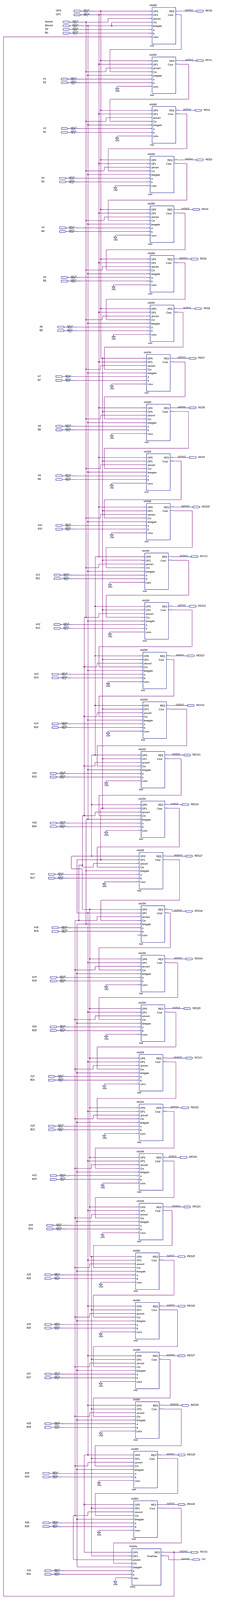
[diagram p0: schematic sheet, whole]
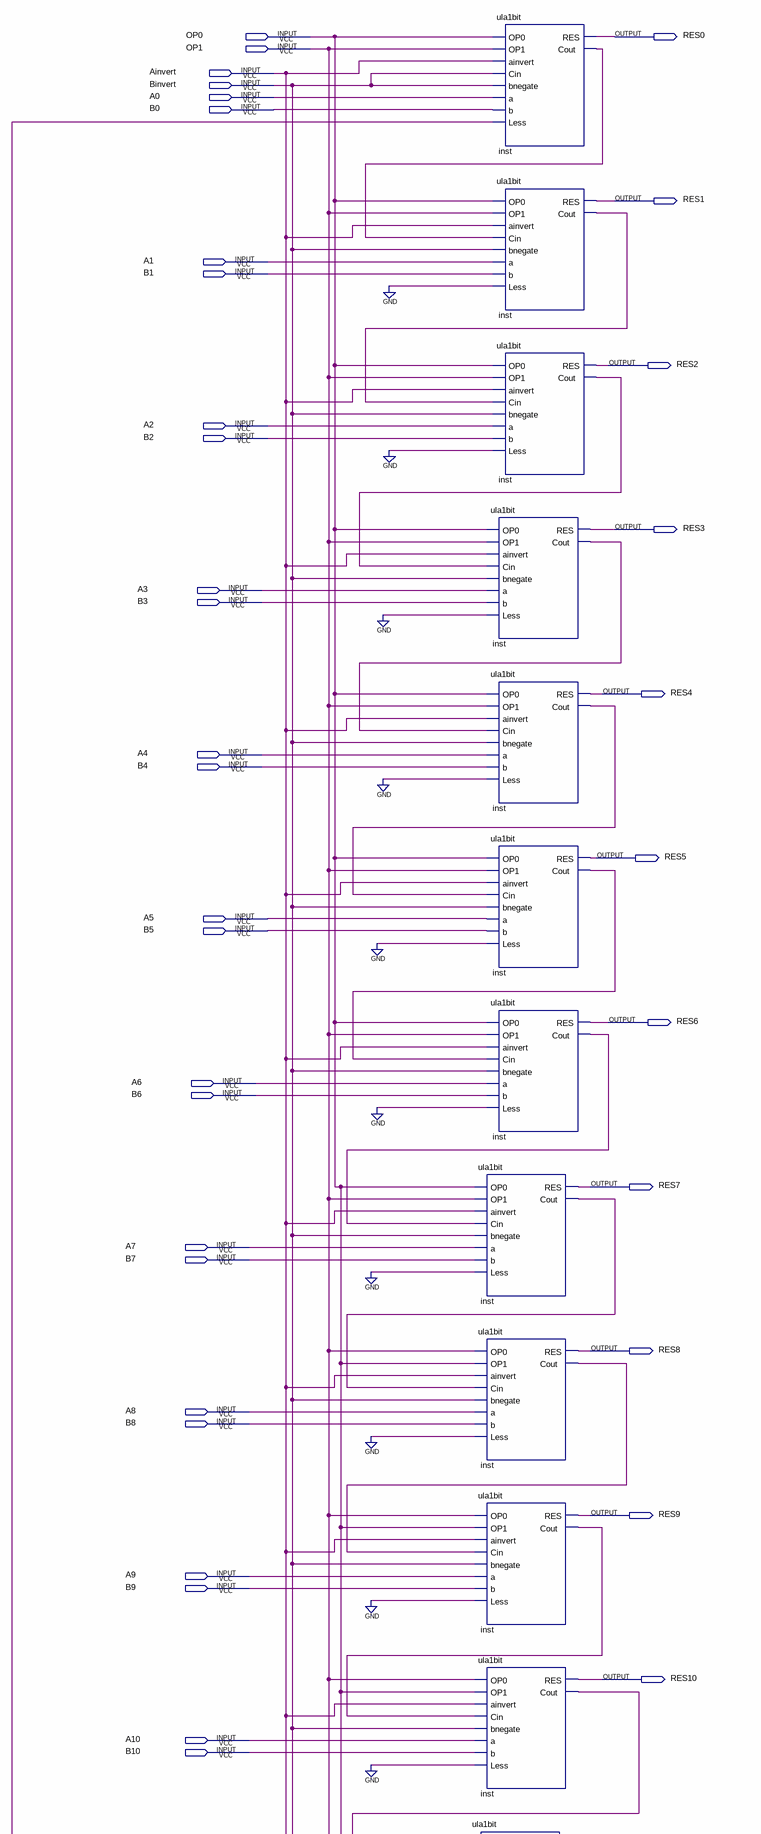
[diagram p1: schematic sheet, upper part]
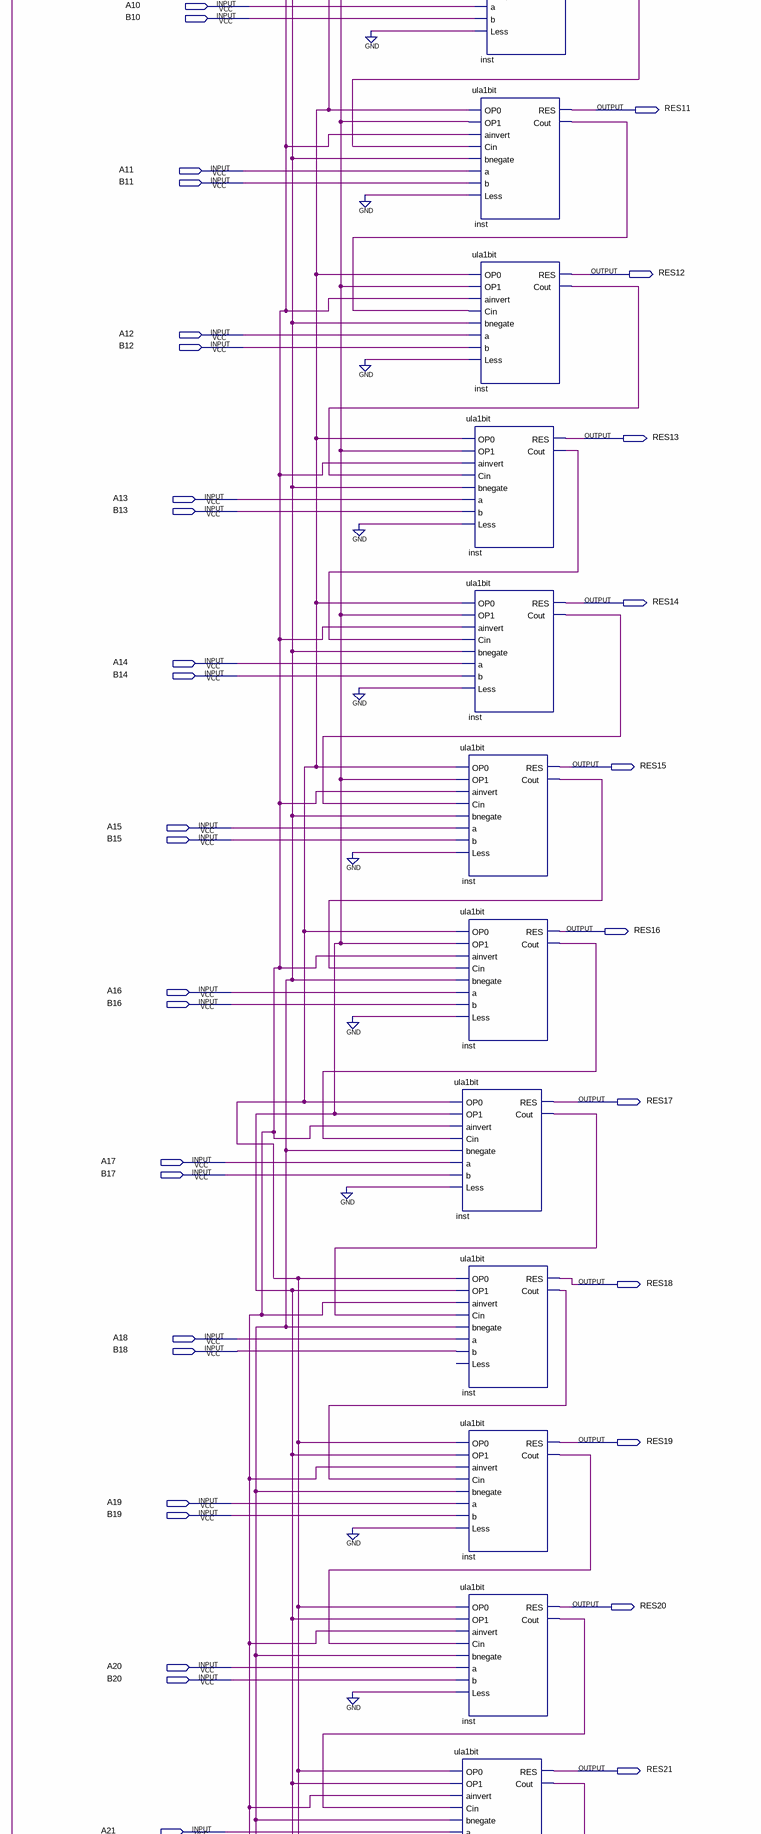
[diagram p2: schematic sheet, middle part]
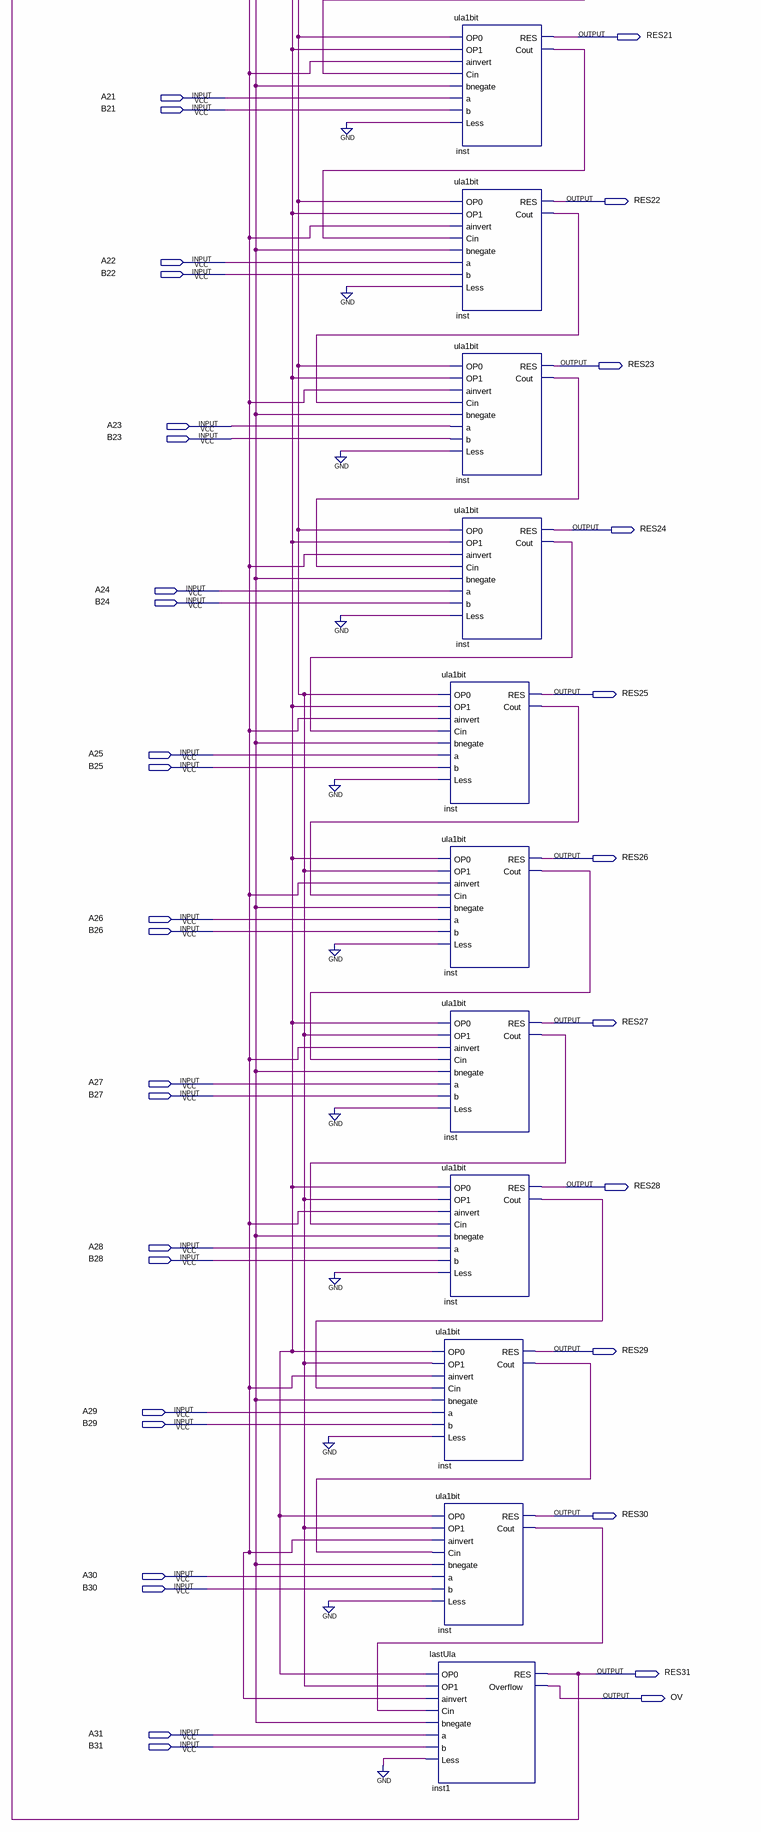
[diagram p3: schematic sheet, lower part]
// Quartus schematic ULA.bdf as structural Verilog: 32 symbols, 101 pins
module ULA (
  input  OP0,
  input  OP1,
  input  Ainvert,
  input  Binvert,
  input  A0,
  input  B0,
  input  A1,
  input  B1,
  input  A2,
  input  B2,
  input  A3,
  input  B3,
  input  A4,
  input  B4,
  input  A5,
  input  B5,
  input  A6,
  input  B6,
  input  A7,
  input  B7,
  input  A8,
  input  B8,
  input  A9,
  input  B9,
  input  A10,
  input  B10,
  input  A11,
  input  B11,
  input  A12,
  input  B12,
  input  A13,
  input  B13,
  input  A14,
  input  B14,
  input  A15,
  input  B15,
  input  A16,
  input  B16,
  input  A17,
  input  B17,
  input  A18,
  input  B18,
  input  A19,
  input  B19,
  input  A20,
  input  B20,
  input  A21,
  input  B21,
  input  A22,
  input  B22,
  input  A23,
  input  B23,
  input  A24,
  input  B24,
  input  A25,
  input  B25,
  input  A26,
  input  B26,
  input  A27,
  input  B27,
  input  A28,
  input  B28,
  input  A29,
  input  B29,
  input  A30,
  input  B30,
  input  A31,
  input  B31,
  output RES0,
  output RES1,
  output RES2,
  output RES3,
  output RES4,
  output RES5,
  output RES6,
  output RES7,
  output RES8,
  output RES9,
  output RES10,
  output RES11,
  output RES12,
  output RES13,
  output RES14,
  output RES15,
  output RES16,
  output RES17,
  output RES18,
  output RES19,
  output RES20,
  output RES21,
  output RES22,
  output RES23,
  output RES24,
  output RES25,
  output RES26,
  output RES27,
  output RES28,
  output RES29,
  output RES30,
  output RES31,
  output OV
);

  wire inst_cout, inst_cout_2, inst_cout_3, inst_cout_4, inst_cout_5, inst_cout_6, inst_cout_7, inst_cout_8,
       inst_cout_9, inst_cout_10, inst_cout_11, inst_cout_12, inst_cout_13, inst_cout_14, inst_cout_15,
       inst_cout_16, inst_cout_17, inst_cout_18, inst_cout_19, inst_cout_20, inst_cout_21, inst_cout_22,
       inst_cout_23, inst_cout_24, inst_cout_25, inst_cout_26, inst_cout_27, inst_cout_28, inst_cout_29,
       inst_cout_30, inst_cout_31;

  ula1bit inst (
    .OP0(OP1), .OP1(OP0), .ainvert(Ainvert), .Cin(inst_cout_17), .bnegate(Binvert), .a(A17), .b(B17),
    .Less(1'b0), .RES(RES17), .Cout(inst_cout_18));
  ula1bit inst_dup2 (
    .OP0(OP1), .OP1(OP0), .ainvert(Ainvert), .Cin(inst_cout_21), .bnegate(Binvert), .a(A21), .b(B21),
    .Less(1'b0), .RES(RES21), .Cout(inst_cout_22));
  ula1bit inst_dup3 (
    .OP0(OP1), .OP1(OP0), .ainvert(Ainvert), .Cin(inst_cout_22), .bnegate(Binvert), .a(A22), .b(B22),
    .Less(1'b0), .RES(RES22), .Cout(inst_cout_23));
  ula1bit inst_dup4 (
    .OP0(OP1), .OP1(OP0), .ainvert(Ainvert), .Cin(inst_cout_23), .bnegate(Binvert), .a(A23), .b(B23),
    .Less(1'b0), .RES(RES23), .Cout(inst_cout_24));
  ula1bit inst_dup5 (
    .OP0(OP1), .OP1(OP0), .ainvert(Ainvert), .Cin(inst_cout_24), .bnegate(Binvert), .a(A24), .b(B24),
    .Less(1'b0), .RES(RES24), .Cout(inst_cout_25));
  ula1bit inst_dup6 (
    .OP0(OP1), .OP1(OP0), .ainvert(Ainvert), .Cin(inst_cout_25), .bnegate(Binvert), .a(A25), .b(B25),
    .Less(1'b0), .RES(RES25), .Cout(inst_cout_26));
  ula1bit inst_dup7 (
    .OP0(OP0), .OP1(OP1), .ainvert(Ainvert), .Cin(inst_cout_26), .bnegate(Binvert), .a(A26), .b(B26),
    .Less(1'b0), .RES(RES26), .Cout(inst_cout_27));
  ula1bit inst_dup8 (
    .OP0(OP0), .OP1(OP1), .ainvert(Ainvert), .Cin(inst_cout_27), .bnegate(Binvert), .a(A27), .b(B27),
    .Less(1'b0), .RES(RES27), .Cout(inst_cout_28));
  ula1bit inst_dup9 (
    .OP0(OP0), .OP1(OP1), .ainvert(Ainvert), .Cin(inst_cout_28), .bnegate(Binvert), .a(A28), .b(B28),
    .Less(1'b0), .RES(RES28), .Cout(inst_cout_30));
  ula1bit inst_dup10 (
    .OP0(OP0), .OP1(OP1), .ainvert(Ainvert), .Cin(inst_cout_30), .bnegate(Binvert), .a(A29), .b(B29),
    .Less(1'b0), .RES(RES29), .Cout(inst_cout_29));
  ula1bit inst_dup11 (
    .OP0(OP0), .OP1(OP1), .ainvert(Ainvert), .Cin(inst_cout_29), .bnegate(Binvert), .a(A30), .b(B30),
    .Less(1'b0), .RES(RES30), .Cout(inst_cout_31));
  lastUla inst1 (
    .OP0(OP0), .OP1(OP1), .ainvert(Ainvert), .Cin(inst_cout_31), .bnegate(Binvert), .a(A31), .b(B31),
    .Less(1'b0), .RES(RES31), .Overflow(OV));
  ula1bit inst_dup12 (
    .OP0(OP0), .OP1(OP1), .ainvert(Ainvert), .Cin(Binvert), .bnegate(Binvert), .a(A0), .b(B0), .Less(RES31),
    .RES(RES0), .Cout(inst_cout));
  ula1bit inst_dup13 (
    .OP0(OP0), .OP1(OP1), .ainvert(Ainvert), .Cin(inst_cout), .bnegate(Binvert), .a(A1), .b(B1), .Less(1'b0),
    .RES(RES1), .Cout(inst_cout_2));
  ula1bit inst_dup14 (
    .OP0(OP0), .OP1(OP1), .ainvert(Ainvert), .Cin(inst_cout_2), .bnegate(Binvert), .a(A2), .b(B2),
    .Less(1'b0), .RES(RES2), .Cout(inst_cout_3));
  ula1bit inst_dup15 (
    .OP0(OP0), .OP1(OP1), .ainvert(Ainvert), .Cin(inst_cout_3), .bnegate(Binvert), .a(A3), .b(B3),
    .Less(1'b0), .RES(RES3), .Cout(inst_cout_4));
  ula1bit inst_dup16 (
    .OP0(OP0), .OP1(OP1), .ainvert(Ainvert), .Cin(inst_cout_4), .bnegate(Binvert), .a(A4), .b(B4),
    .Less(1'b0), .RES(RES4), .Cout(inst_cout_5));
  ula1bit inst_dup17 (
    .OP0(OP0), .OP1(OP1), .ainvert(Ainvert), .Cin(inst_cout_5), .bnegate(Binvert), .a(A5), .b(B5),
    .Less(1'b0), .RES(RES5), .Cout(inst_cout_6));
  ula1bit inst_dup18 (
    .OP0(OP0), .OP1(OP1), .ainvert(Ainvert), .Cin(inst_cout_6), .bnegate(Binvert), .a(A6), .b(B6),
    .Less(1'b0), .RES(RES6), .Cout(inst_cout_7));
  ula1bit inst_dup19 (
    .OP0(OP0), .OP1(OP1), .ainvert(Ainvert), .Cin(inst_cout_7), .bnegate(Binvert), .a(A7), .b(B7),
    .Less(1'b0), .RES(RES7), .Cout(inst_cout_8));
  ula1bit inst_dup20 (
    .OP0(OP1), .OP1(OP0), .ainvert(Ainvert), .Cin(inst_cout_8), .bnegate(Binvert), .a(A8), .b(B8),
    .Less(1'b0), .RES(RES8), .Cout(inst_cout_9));
  ula1bit inst_dup21 (
    .OP0(OP1), .OP1(OP0), .ainvert(Ainvert), .Cin(inst_cout_9), .bnegate(Binvert), .a(A9), .b(B9),
    .Less(1'b0), .RES(RES9), .Cout(inst_cout_10));
  ula1bit inst_dup22 (
    .OP0(OP1), .OP1(OP0), .ainvert(Ainvert), .Cin(inst_cout_10), .bnegate(Binvert), .a(A10), .b(B10),
    .Less(1'b0), .RES(RES10), .Cout(inst_cout_12));
  ula1bit inst_dup23 (
    .OP0(OP1), .OP1(OP0), .ainvert(Ainvert), .Cin(inst_cout_12), .bnegate(Binvert), .a(A11), .b(B11),
    .Less(1'b0), .RES(RES11), .Cout(inst_cout_11));
  ula1bit inst_dup24 (
    .OP0(OP1), .OP1(OP0), .ainvert(Ainvert), .Cin(inst_cout_11), .bnegate(Binvert), .a(A12), .b(B12),
    .Less(1'b0), .RES(RES12), .Cout(inst_cout_13));
  ula1bit inst_dup25 (
    .OP0(OP1), .OP1(OP0), .ainvert(Ainvert), .Cin(inst_cout_13), .bnegate(Binvert), .a(A13), .b(B13),
    .Less(1'b0), .RES(RES13), .Cout(inst_cout_14));
  ula1bit inst_dup26 (
    .OP0(OP1), .OP1(OP0), .ainvert(Ainvert), .Cin(inst_cout_14), .bnegate(Binvert), .a(A14), .b(B14),
    .Less(1'b0), .RES(RES14), .Cout(inst_cout_15));
  ula1bit inst_dup27 (
    .OP0(OP1), .OP1(OP0), .ainvert(Ainvert), .Cin(inst_cout_15), .bnegate(Binvert), .a(A15), .b(B15),
    .Less(1'b0), .RES(RES15), .Cout(inst_cout_16));
  ula1bit inst_dup28 (
    .OP0(OP1), .OP1(OP0), .ainvert(Ainvert), .Cin(inst_cout_16), .bnegate(Binvert), .a(A16), .b(B16),
    .Less(1'b0), .RES(RES16), .Cout(inst_cout_17));
  ula1bit inst_dup29 (
    .OP0(OP1), .OP1(OP0), .ainvert(Ainvert), .Cin(inst_cout_18), .bnegate(Binvert), .a(A18), .b(B18),
    .RES(RES18), .Cout(inst_cout_19));  // open: Less
  ula1bit inst_dup30 (
    .OP0(OP1), .OP1(OP0), .ainvert(Ainvert), .Cin(inst_cout_19), .bnegate(Binvert), .a(A19), .b(B19),
    .Less(1'b0), .RES(RES19), .Cout(inst_cout_20));
  ula1bit inst_dup31 (
    .OP0(OP1), .OP1(OP0), .ainvert(Ainvert), .Cin(inst_cout_20), .bnegate(Binvert), .a(A20), .b(B20),
    .Less(1'b0), .RES(RES20), .Cout(inst_cout_21));
endmodule
